# Altium schematic sheet Main.SchDoc: =ProjectName
size A4; CheckedBy: DatNB; Author: Ven; CompanyName: Nacentech; Organization: IMET
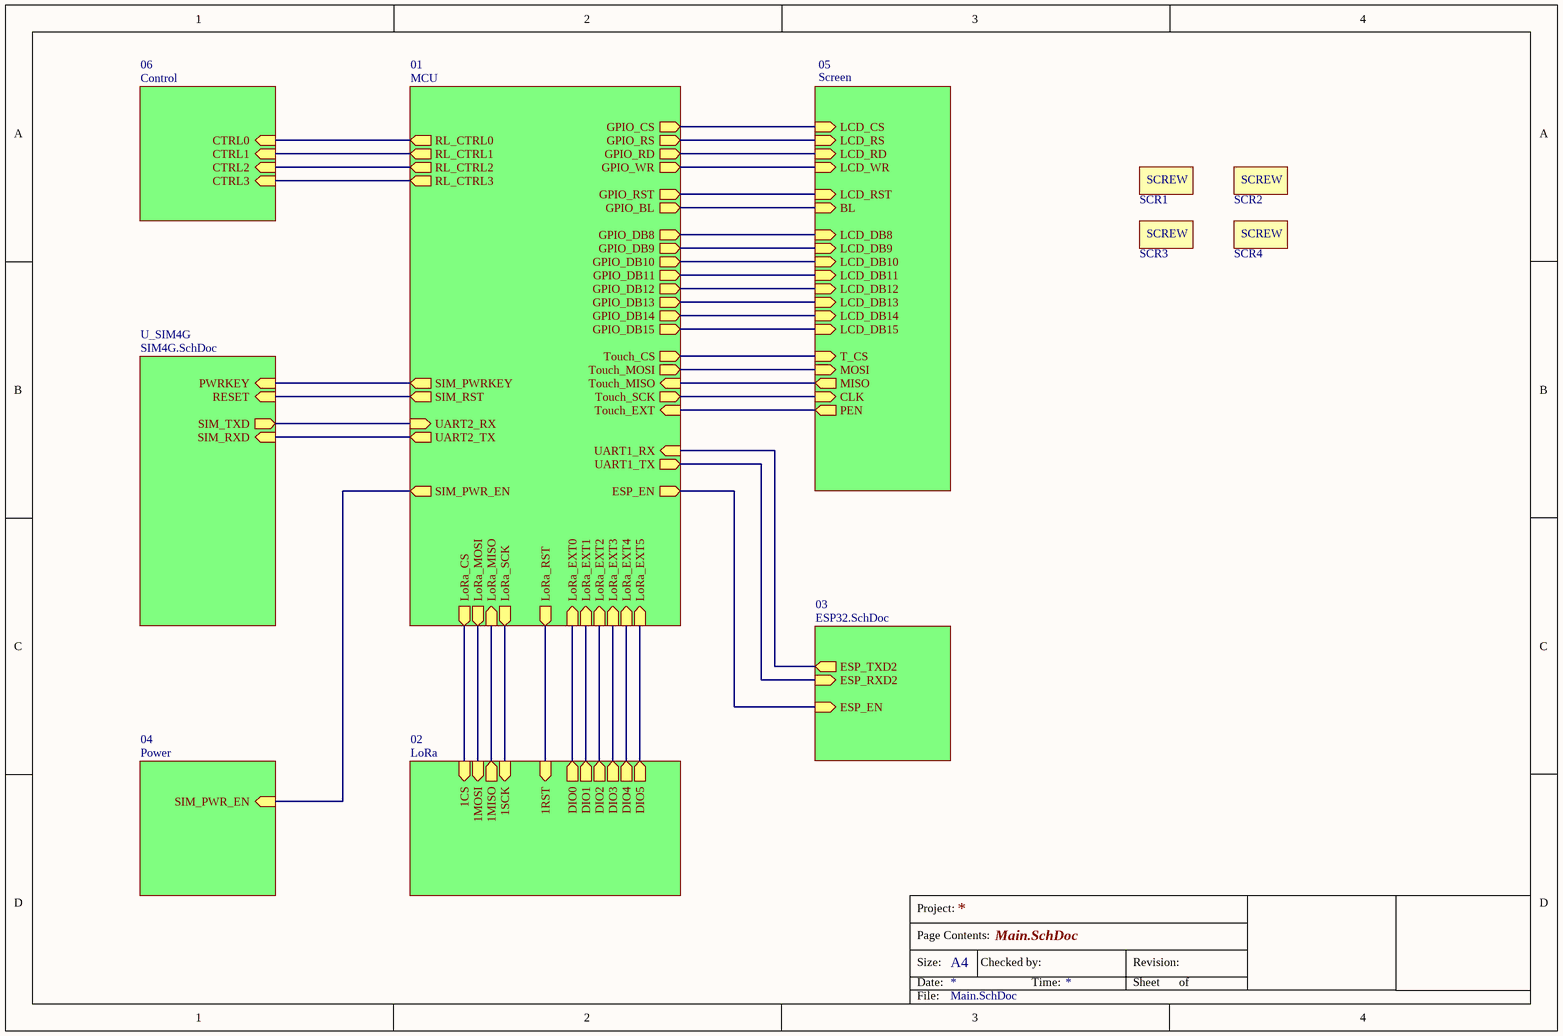
[diagram p0: Main.SchDoc]

## Parts
SCR1  Screw 3mm  [SCREW]  (value not drawn)
SCR2  Screw 3mm  [SCREW]  (value not drawn)
SCR3  Screw 3mm  [SCREW]  (value not drawn)
SCR4  Screw 3mm  [SCREW]  (value not drawn)

## Sub-sheets
01 = MCU: GPIO_WR (out), GPIO_RD (out), LoRa_RST (out), LoRa_CS (out), GPIO_BL (out), GPIO_CS (out), LoRa_MOSI (out), LoRa_SCK (out), LoRa_MISO (in), GPIO_RST (out), GPIO_RS (out), RL_CTRL3 (out), RL_CTRL0 (out), RL_CTRL1 (out), RL_CTRL2 (out), UART2_RX (in), UART2_TX (out), GPIO_DB10 (out), GPIO_DB13 (out), GPIO_DB12 (out), GPIO_DB14 (out), GPIO_DB8 (out), GPIO_DB15 (out), GPIO_DB11 (out), GPIO_DB9 (out), Touch_CS (out), Touch_SCK (out), Touch_MOSI (out), Touch_MISO (in), UART1_RX (in), LoRa_EXT4 (in), Touch_EXT (in), ESP_EN (out), LoRa_EXT0 (in), UART1_TX (out), LoRa_EXT2 (in), SIM_RST (out), LoRa_EXT5 (in), LoRa_EXT1 (in), SIM_PWR_EN (out), SIM_PWRKEY (out), LoRa_EXT3 (in)
02 = LoRa: 1MOSI (in), DIO5 (out), DIO3 (out), DIO4 (out), DIO2 (out), 1SCK (in), DIO1 (out), DIO0 (out), 1CS (in), 1MISO (out), 1RST (in)
03 = ESP32.SchDoc: ESP_TXD2 (out), ESP_RXD2 (in), ESP_EN (in)
04 = Power: SIM_PWR_EN (in)
05 = Screen: BL (in), LCD_RS (in), LCD_RD (in), LCD_WR (in), LCD_RST (in), LCD_CS (in), LCD_DB15 (in), LCD_DB12 (in), LCD_DB9 (in), LCD_DB13 (in), LCD_DB10 (in), LCD_DB8 (in), LCD_DB14 (in), LCD_DB11 (in), CLK (in), MISO (out), T_CS (in), PEN (out), MOSI (in)
06 = Control: CTRL0 (in), CTRL2 (in), CTRL1 (in), CTRL3 (in)
U_SIM4G = SIM4G.SchDoc: PWRKEY (in), RESET (in), SIM_TXD (out), SIM_RXD (in)

## Nets
(unnamed): sheet 01/GPIO_WR, sheet 05/LCD_WR
(unnamed): sheet 01/GPIO_RD, sheet 05/LCD_RD
(unnamed): sheet 01/LoRa_RST, sheet 02/1RST
(unnamed): sheet 01/LoRa_CS, sheet 02/1CS
(unnamed): sheet 01/GPIO_BL, sheet 05/BL
(unnamed): sheet 01/GPIO_CS, sheet 05/LCD_CS
(unnamed): sheet 01/LoRa_MOSI, sheet 02/1MOSI
(unnamed): sheet 01/LoRa_SCK, sheet 02/1SCK
(unnamed): sheet 01/LoRa_MISO, sheet 02/1MISO
(unnamed): sheet 01/GPIO_RST, sheet 05/LCD_RST
(unnamed): sheet 01/GPIO_RS, sheet 05/LCD_RS
(unnamed): sheet 01/RL_CTRL3, sheet 06/CTRL3
(unnamed): sheet 01/RL_CTRL0, sheet 06/CTRL0
(unnamed): sheet 01/RL_CTRL1, sheet 06/CTRL1
(unnamed): sheet 01/RL_CTRL2, sheet 06/CTRL2
(unnamed): sheet 01/UART2_RX, sheet U_SIM4G/SIM_TXD
(unnamed): sheet 01/UART2_TX, sheet U_SIM4G/SIM_RXD
(unnamed): sheet 01/GPIO_DB10, sheet 05/LCD_DB10
(unnamed): sheet 01/GPIO_DB13, sheet 05/LCD_DB13
(unnamed): sheet 01/GPIO_DB12, sheet 05/LCD_DB12
(unnamed): sheet 01/GPIO_DB14, sheet 05/LCD_DB14
(unnamed): sheet 01/GPIO_DB8, sheet 05/LCD_DB8
(unnamed): sheet 01/GPIO_DB15, sheet 05/LCD_DB15
(unnamed): sheet 01/GPIO_DB11, sheet 05/LCD_DB11
(unnamed): sheet 01/GPIO_DB9, sheet 05/LCD_DB9
(unnamed): sheet 01/Touch_CS, sheet 05/T_CS
(unnamed): sheet 01/Touch_SCK, sheet 05/CLK
(unnamed): sheet 01/Touch_MOSI, sheet 05/MOSI
(unnamed): sheet 01/Touch_MISO, sheet 05/MISO
(unnamed): sheet 01/UART1_RX, sheet 03/ESP_TXD2
(unnamed): sheet 01/LoRa_EXT4, sheet 02/DIO4
(unnamed): sheet 01/Touch_EXT, sheet 05/PEN
(unnamed): sheet 01/ESP_EN, sheet 03/ESP_EN
(unnamed): sheet 01/LoRa_EXT0, sheet 02/DIO0
(unnamed): sheet 01/UART1_TX, sheet 03/ESP_RXD2
(unnamed): sheet 01/LoRa_EXT2, sheet 02/DIO2
(unnamed): sheet 01/SIM_RST, sheet U_SIM4G/RESET
(unnamed): sheet 01/LoRa_EXT5, sheet 02/DIO5
(unnamed): sheet 01/LoRa_EXT1, sheet 02/DIO1
(unnamed): sheet 01/SIM_PWR_EN, sheet 04/SIM_PWR_EN
(unnamed): sheet 01/SIM_PWRKEY, sheet U_SIM4G/PWRKEY
(unnamed): sheet 01/LoRa_EXT3, sheet 02/DIO3

Not connected (* = marked no-connect by the designer): SCR1 0; SCR2 0; SCR3 0; SCR4 0

## Notes on the sheet
- Project:
- Page Contents:
- Size:
- Date:
- A4
- Checked by:
- Time:
- Revision:
- Sheet
- of
- File:
- (in symbol screw3m) SCREW

## Library data of the parts
SCR1-SCR4 = screw3m